# Altium schematic sheet IO.SchDoc
size A4; SheetNumber: 2; SheetTotal: 10
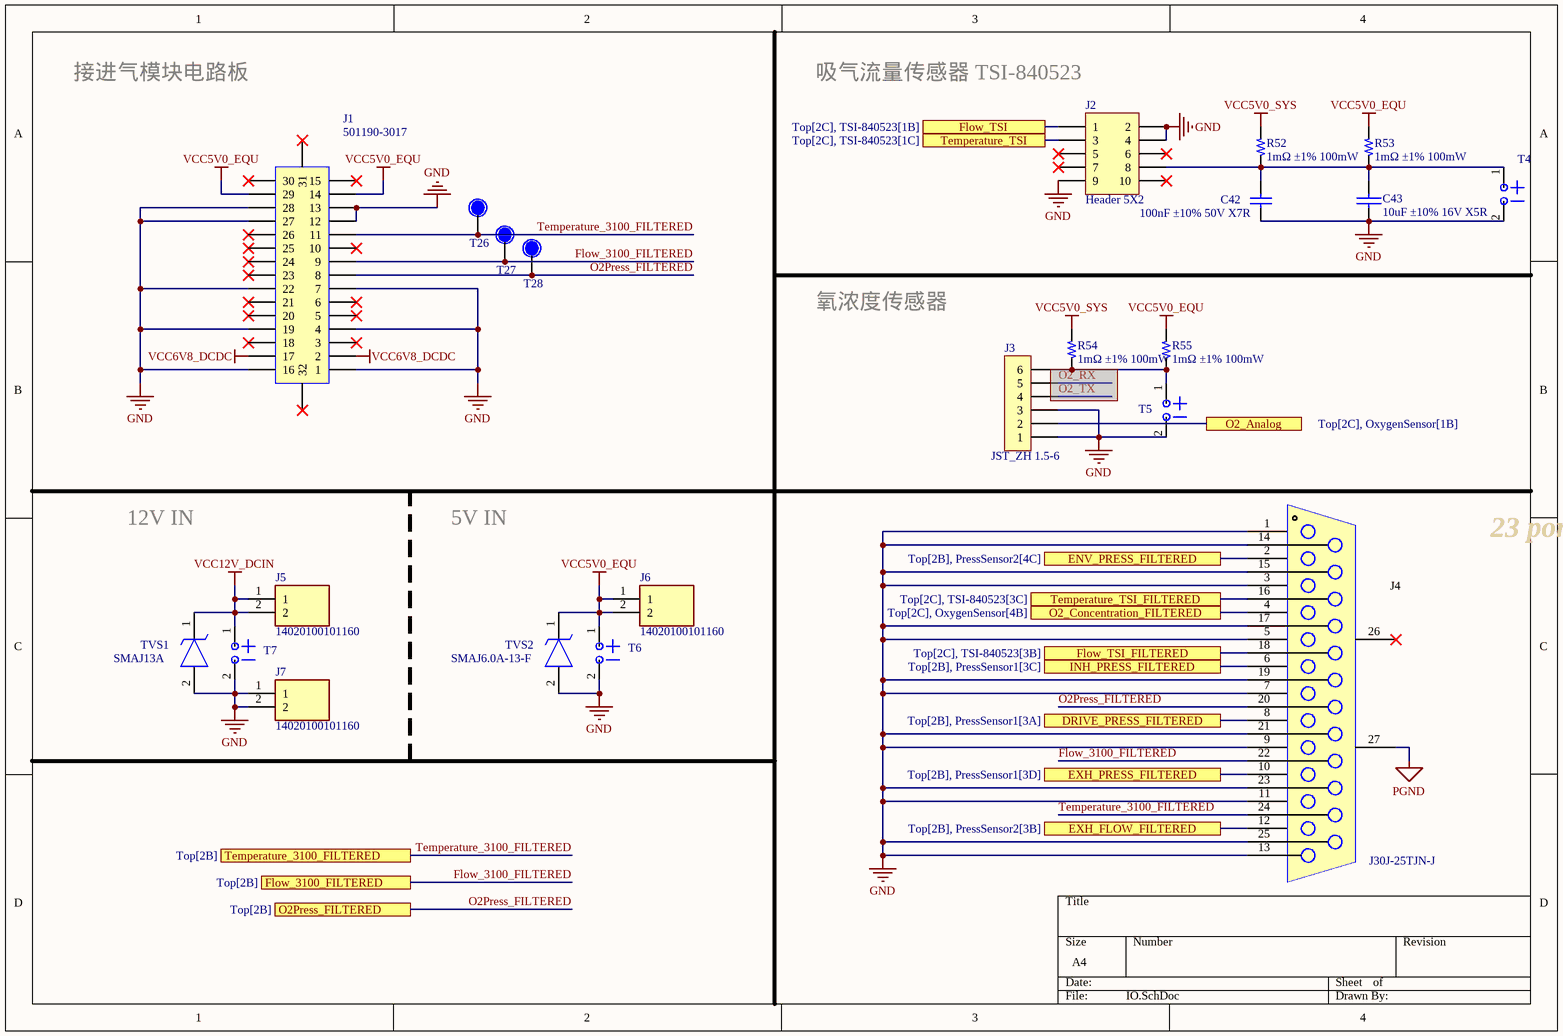
[diagram p0: IO.SchDoc]

## Parts
C42  100nF ±10% 50V X7R  [C-0603]
C43  10uF ±10% 16V X5R  [C-0805]
J1  501190-3017  [501190-3017]
J2  Header 5X2  [878311041]
J3  JST_ZH 1.5-6  [JST_ZH 1.5-6]
J4  J30J-25TJN-J  [J30J-25TJN-J]
J5  14020100101160  [14020100101160]
J6  14020100101160  [14020100101160]
J7  14020100101160  [14020100101160]
R52  1mΩ ±1% 100mW  [R-0603]
R53  1mΩ ±1% 100mW  [R-0603]
R54  1mΩ ±1% 100mW  [R-0603]
R55  1mΩ ±1% 100mW  [R-0603]
T4  POWER_TEST  [BT]  (value not drawn)  (no BOM)
T5  POWER_TEST  [BT]  (value not drawn)  (no BOM)
T6  POWER_TEST  [BT]  (value not drawn)  (no BOM)
T7  POWER_TEST  [BT]  (value not drawn)  (no BOM)
T26  Test?  [TestPad_SMD]  (value not drawn)
T27  Test?  [TestPad_SMD]  (value not drawn)
T28  Test?  [TestPad_SMD]  (value not drawn)
TVS1  SMAJ13A  [DIONM5126X250N]
TVS2  SMAJ6.0A-13-F  [DIOM5226X240N]

## Ports
DRIVE_PRESS_FILTERED (see Top[2B], PressSensor1[3A]), ENV_PRESS_FILTERED (see Top[2B], PressSensor2[4C]), EXH_FLOW_FILTERED (see Top[2B], PressSensor2[3B]), EXH_PRESS_FILTERED (see Top[2B], PressSensor1[3D]), Flow_3100_FILTERED (see Top[2B]), Flow_TSI (see Top[2C], TSI-840523[1B]), Flow_TSI_FILTERED (see Top[2C], TSI-840523[3B]), INH_PRESS_FILTERED (see Top[2B], PressSensor1[3C]), O2_Analog (see Top[2C], OxygenSensor[1B]), O2_Concentration_FILTERED (see Top[2C], OxygenSensor[4B]), O2Press_FILTERED (see Top[2B]), Temperature_3100_FILTERED (see Top[2B]), Temperature_TSI (see Top[2C], TSI-840523[1C]), Temperature_TSI_FILTERED (see Top[2C], TSI-840523[3C])

## Nets
GND: C42.1 C43.1 J1.1 J1.4 J1.7 J1.12 J1.13 J1.16 J1.19 J1.22 J1.27 J1.28 J2.2 J2.4 J2.9 J3.1 J3.3 J4.1 J4.3 J4.5 J4.7 J4.9 J4.11 J4.13 J4.14 J4.15 J4.17 J4.19 J4.21 J4.23 J4.25 J7.1 J7.2 T4.2(-) T5.2(-) T6.2(-) T7.2(-) TVS1.2(A) TVS2.2(A)
PGND: J4.27
VCC5V0_EQU: J1.14 J1.29 J6.1 J6.2 R53.2(BOT) R55.2(BOT) T6.1(+) TVS2.1(K)
VCC5V0_SYS: R52.2(BOT) R54.2(BOT)
VCC6V8_DCDC: J1.2 J1.17
VCC12V_DCIN: J5.1 J5.2 T7.1(+) TVS1.1(K)
DRIVE_PRESS_FILTERED: J4.8 ; port DRIVE_PRESS_FILTERED
ENV_PRESS_FILTERED: J4.2 ; port ENV_PRESS_FILTERED
EXH_FLOW_FILTERED: J4.12 ; port EXH_FLOW_FILTERED
EXH_PRESS_FILTERED: J4.10 ; port EXH_PRESS_FILTERED
Flow_3100_FILTERED: J1.9 J4.22 T27.1 ; port Flow_3100_FILTERED
Flow_TSI: J2.1 ; port Flow_TSI
Flow_TSI_FILTERED: J4.18 ; port Flow_TSI_FILTERED
INH_PRESS_FILTERED: J4.6 ; port INH_PRESS_FILTERED
O2_Analog: J3.2 ; port O2_Analog
O2_Concentration_FILTERED: J4.4 ; port O2_Concentration_FILTERED
O2Press_FILTERED: J1.8 J4.20 T28.1 ; port O2Press_FILTERED
Temperature_3100_FILTERED: J1.11 J4.24 T26.1 ; port Temperature_3100_FILTERED
Temperature_TSI: J2.3 ; port Temperature_TSI
Temperature_TSI_FILTERED: J4.16 ; port Temperature_TSI_FILTERED
NetC42_2: C42.2 C43.2 J2.8 R52.1(TOP) R53.1(TOP) T4.1(+)
NetJ3_6: J3.6 R54.1(TOP) R55.1(TOP) T5.1(+)

Not connected (* = marked no-connect by the designer): J1 3* 5* 6* 10* 15* 18* 20* 21* 23* 24* 25* 26* 30* 31* 32*; J2 5* 6* 7* 10*; J3 4 5; J4 26*

## Notes on the sheet
- 接进气模块电路板
- 吸气流量传感器 TSI-840523
- 氧浓度传感器
- 12V IN
- 5V IN
- (near J4) 23 ports

## Library data of the parts
C42 = 100nF_1: 物料编号: 210001894; 详细描述: X7R,50V,三星CL21B104JBCNNNC; 版本: V1.00; 名称: 贴片瓷介电容100nF±5%,0805; 制造商: 三星
C43 = CAP: Capacitor
J2 = Header 5X2: Header, 5-Pin, Dual row; LatestRevisionDate: 17-Jul-2002; LatestRevisionNote: Re-released for DXP Platform.; Publisher: Altium Limited
J3 = JST_ZH 1.5-6: 品牌：JST 型号：B6B-ZR，直插，间距1.5，6pin; 名称: 插座2针，2.0间距; 制造商: JST
J4 = J30J-25TJN-J: Manufacturer: BOOMELE(博穆精密); Name: GH1.25-5PLTPZ; Add into BOM: yes; Symbol: GH1.25-5PLTPZ; Device: GH1.25-5PLTPZ; LCSC Part Name: GH1.25-5P立贴编带加盖; Supplier Part: C2829263; Manufacturer Part: GH1.25-5PLTPZ; Supplier Footprint: -; JLCPCB Part Class: Extended Part; Datasheet: https://atta.szlcsc.com/upload/public/pdf/source/20211125/08A09A4909F58AF780B71FE423A00F7E.pdf; Supplier: LCSC; Convert to PCB: yes
J5-J7 = 14020100101160: Connector; Manufacturer_Name: HARTING; Datasheet Link: https://g.componentsearchengine.com/Datasheets/0/17149084.pdf; Height: 6.65mm; Manufacturer_Part_Number: 14020100101160
R52-R55 = 10K_1: 国巨 / 1mΩ ±1% 100mW; 版本: V1.00; 名称: 贴片电阻10K±1%; 物料编号: 210001830; 详细描述: 0805,1/8W,国巨RC0805FR-0710K; 制造商: 国巨
T26-T28 = TestPad_SMD
TVS1 = SMAJ13A: TVS Diode (Uni-directional); Manufacturer_Name: LITTELFUSE; Datasheet Link: https://componentsearchengine.com/Datasheets/2/SMAJ13A.pdf; Height: 2.5mm; Manufacturer_Part_Number: SMAJ13A; Mouser Part Number: 576-SMAJ13A; Mouser Price/Stock: https://www.mouser.co.uk/ProductDetail/Littelfuse/SMAJ13A?qs=HR2RnyOI4E60xAs7pDj%2F%252BA%3D%3D; Arrow Part Number: SMAJ13A; Arrow Price/Stock: https://www.arrow.com/en/products/smaj13a/littelfuse
TVS2 = SMAJ6.0A-13-F: TVS Diode (Uni-directional); Manufacturer_Name: Diodes Incorporated; Datasheet Link: https://www.arrow.com/en/products/smaj6.0a-13-f/diodes-incorporated; Height: 2.4mm; Manufacturer_Part_Number: SMAJ6.0A-13-F; Mouser Part Number: 621-SMAJ6.0A-13-F; Mouser Price/Stock: https://www.mouser.co.uk/ProductDetail/Diodes-Incorporated/SMAJ60A-13-F?qs=gaDBXWSqsDBS%252B5NeClx%252BYA%3D%3D; Arrow Part Number: SMAJ6.0A-13-F; Arrow Price/Stock: https://www.arrow.com/en/products/smaj6.0a-13-f/diodes-incorporated?region=nac